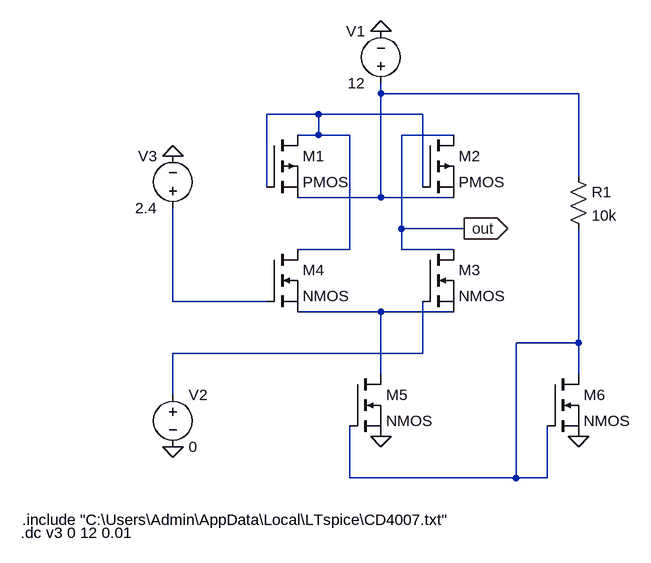
[diagram p0: schematic EW2_project1_amp stage_1.asc]
EW2_project1_amp stage_1.asc, the LTspice schematic file:
Version 4
SHEET 1 880 680
WIRE 256 -32 256 -48
WIRE 560 -32 256 -32
WIRE 160 0 80 0
WIRE 320 0 160 0
WIRE 160 32 160 0
WIRE 160 32 128 32
WIRE 208 32 160 32
WIRE 368 32 288 32
WIRE 560 96 560 -32
WIRE 80 112 80 0
WIRE 320 112 320 0
WIRE 256 128 256 -32
WIRE 256 128 128 128
WIRE 368 128 256 128
WIRE 288 176 288 32
WIRE 384 176 288 176
WIRE 208 208 208 32
WIRE 208 208 128 208
WIRE 288 208 288 176
WIRE 368 208 288 208
WIRE -64 288 -64 144
WIRE 80 288 -64 288
WIRE 256 304 128 304
WIRE 368 304 256 304
WIRE 560 352 560 176
WIRE 560 352 464 352
WIRE 320 368 320 288
WIRE 320 368 -64 368
WIRE 256 400 256 304
WIRE 560 400 560 352
WIRE -64 432 -64 368
WIRE 208 560 208 480
WIRE 464 560 464 352
WIRE 464 560 208 560
WIRE 512 560 512 480
WIRE 512 560 464 560
FLAG 256 -128 0
FLAG 256 496 0
FLAG 560 496 0
FLAG 384 176 out
IOPIN 384 176 Out
FLAG -64 64 0
FLAG -64 512 0
SYMBOL pmos 80 32 R0
SYMATTR InstName M1
SYMBOL pmos 320 32 R0
SYMATTR InstName M2
SYMBOL nmos 320 208 R0
SYMATTR InstName M3
SYMBOL nmos 80 208 R0
SYMATTR InstName M4
SYMBOL voltage 256 -32 R180
WINDOW 0 24 96 Left 2
WINDOW 3 24 16 Left 2
WINDOW 123 0 0 Left 0
WINDOW 39 0 0 Left 0
SYMATTR InstName V1
SYMATTR Value 12
SYMBOL nmos 208 400 R0
SYMATTR InstName M5
SYMBOL nmos 512 400 R0
SYMATTR InstName M6
SYMBOL res 544 80 R0
SYMATTR InstName R1
SYMATTR Value 10k
SYMBOL voltage -64 416 R0
WINDOW 123 0 0 Left 0
WINDOW 39 0 0 Left 0
SYMATTR InstName V2
SYMATTR Value 0
SYMBOL voltage -64 160 R180
WINDOW 0 24 96 Left 2
WINDOW 3 24 16 Left 2
WINDOW 123 24 -12 Left 2
WINDOW 39 0 0 Left 0
SYMATTR InstName V3
SYMATTR Value 2.4
TEXT -296 624 Left 2 !.include "C:\\Users\\Admin\\AppData\\Local\\LTspice\\CD4007.txt"
TEXT -298 644 Left 2 !.dc v3 0 12 0.01

The netlist it stands for:
* EW2_project1_amp stage_1.asc
M1 N002 N002 N001 N001 PMOS
M2 out N002 N001 N001 PMOS
M3 out N006 N004 N004 NMOS
M4 N002 N003 N004 N004 NMOS
V1 N001 0 12
M5 N004 N005 0 0 NMOS
M6 N005 N005 0 0 NMOS
R1 N001 N005 10k
V2 N006 0 0
V3 N003 0 2.4
.model NMOS NMOS
.model PMOS PMOS
.lib standard.mos
.include "C:\Users\Admin\AppData\Local\LTspice\CD4007.txt"
.dc v3 0 12 0.01
.backanno
.end